# EAGLE schematic circuit (EAGLE 9.4.0)
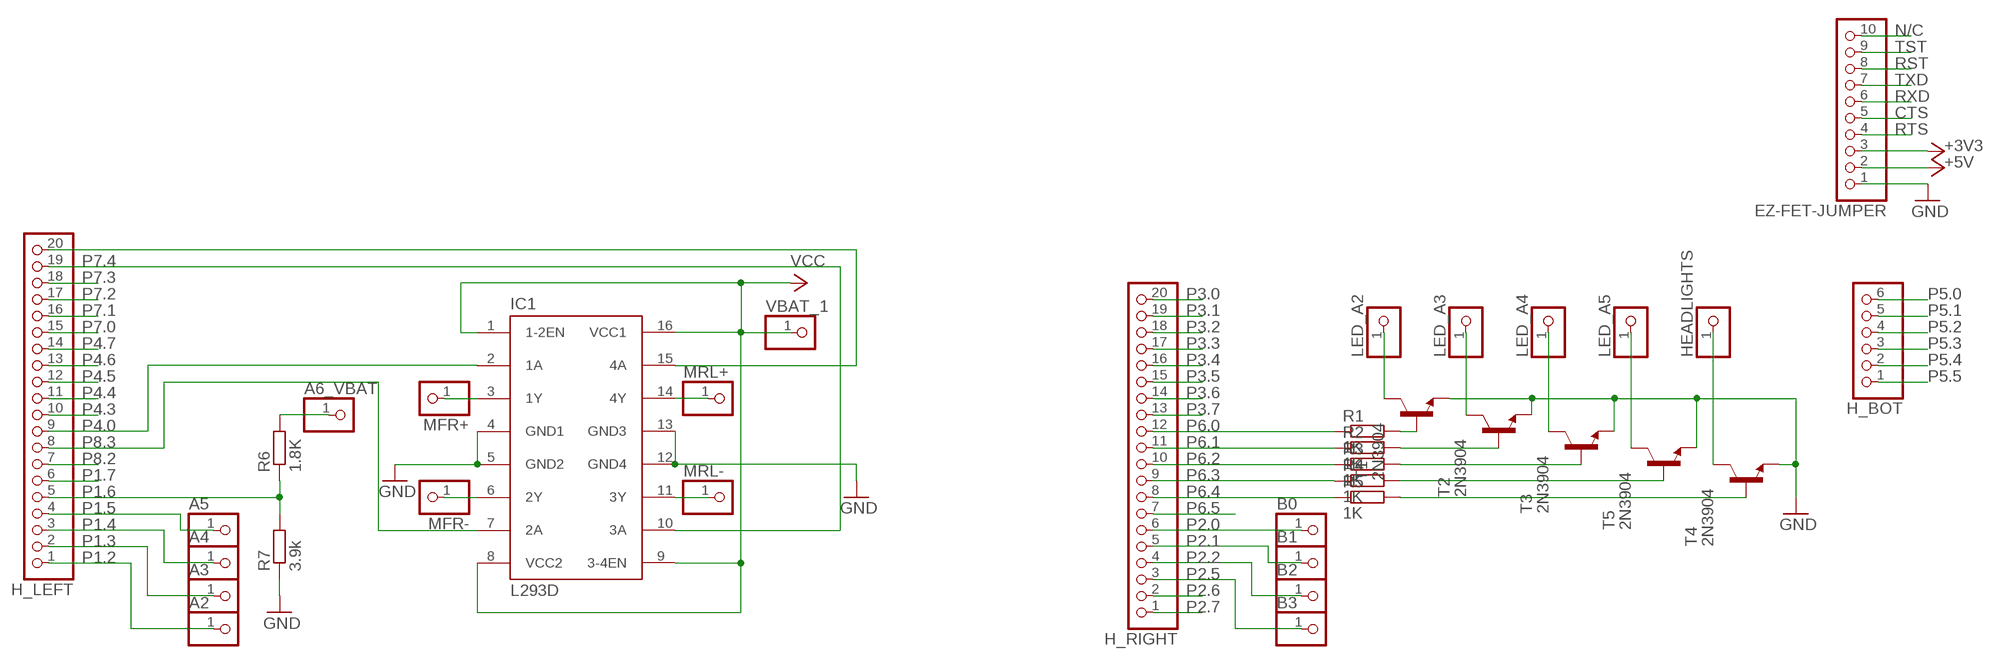
[diagram p0: schematic, sheet 1]

## Parts
A2  PINHD-1X1  [1X01]
A3  PINHD-1X1  [1X01]
A4  PINHD-1X1  [1X01]
A5  PINHD-1X1  [1X01]
A6_VBAT  PINHD-1X1  [1X01]
B0  PINHD-1X1  [1X01]
B1  PINHD-1X1  [1X01]
B2  PINHD-1X1  [1X01]
B3  PINHD-1X1  [1X01]
EZ-FET-JUMPER  PINHD-1X10  [1X10]
H_BOT  PINHD-1X6  [1X06]
H_LEFT  PINHD-1X20  [1X20]
H_RIGHT  PINHD-1X20  [1X20]
HEADLIGHTS  PINHD-1X1  [1X01]
IC1  L293D  [DIL16]
LED_A2  PINHD-1X1  [1X01]
LED_A3  PINHD-1X1  [1X01]
LED_A4  PINHD-1X1  [1X01]
LED_A5  PINHD-1X1  [1X01]
MFR+  PINHD-1X1  [1X01]
MFR-  PINHD-1X1  [1X01]
MRL+  PINHD-1X1  [1X01]
MRL-  PINHD-1X1  [1X01]
R1  1K  R-EU_0207/7  [0207/7]
R2  1K  R-EU_0207/7  [0207/7]
R3  1K  R-EU_0207/7  [0207/7]
R4  1K  R-EU_0207/7  [0207/7]
R5  1K  R-EU_0207/7  [0207/7]
R6  1.8K  R-EU_0207/7  [0207/7]
R7  3.9k  R-EU_0207/7  [0207/7]
T1  2N3904  [TO92]
T2  2N3904  [TO92]
T3  2N3904  [TO92]
T4  2N3904  [TO92]
T5  2N3904  [TO92]
VBAT_1  PINHD-1X1  [1X01]

## Nets
+3V3: EZ-FET-JUMPER.3
+5V: EZ-FET-JUMPER.2
CTS: EZ-FET-JUMPER.5
GND: EZ-FET-JUMPER.1 IC1.4(GND1) IC1.5(GND2) IC1.12(GND4) IC1.13(GND3) R7.1 T1.3(E) T2.3(E) T3.3(E) T4.3(E) T5.3(E)
LED_A3: LED_A3.1 T2.1(C)
N$1: R1.2 T1.2(B)
N$2: R2.2 T2.2(B)
N$3: R3.2 T3.2(B)
N$4: R4.2 T5.2(B)
N$5: R5.2 T4.2(B)
N$6: LED_A2.1 T1.1(C)
N$7: A6_VBAT.1 R6.2
N$8: LED_A4.1 T3.1(C)
N$9: LED_A5.1 T5.1(C)
N$10: HEADLIGHTS.1 T4.1(C)
N$11: IC1.3(1Y) MFR+.1
N$12: IC1.6(2Y) MFR-.1
N$13: IC1.11(3Y) MRL-.1
N$14: IC1.14(4Y) MRL+.1
N/C: EZ-FET-JUMPER.10
P1.2: A2.1 H_LEFT.1
P1.3: A3.1 H_LEFT.2
P1.4: A4.1 H_LEFT.3
P1.5: A5.1 H_LEFT.4
P1.6: H_LEFT.5 R6.1 R7.2
P1.7: H_LEFT.6
P2.0: B0.1 H_RIGHT.6
P2.1: B1.1 H_RIGHT.5
P2.2: B2.1 H_RIGHT.4
P2.5: B3.1 H_RIGHT.3
P2.6: H_RIGHT.2
P2.7: H_RIGHT.1
P3.0: H_RIGHT.20
P3.1: H_RIGHT.19
P3.2: H_RIGHT.18
P3.3: H_RIGHT.17
P3.4: H_RIGHT.16
P3.5: H_RIGHT.15
P3.6: H_RIGHT.14
P3.7: H_RIGHT.13
P4.0: H_LEFT.9 IC1.2(1A)
P4.3: H_LEFT.10
P4.4: H_LEFT.11
P4.5: H_LEFT.12
P4.6: H_LEFT.13
P4.7: H_LEFT.14
P5.0: H_BOT.6
P5.1: H_BOT.5
P5.2: H_BOT.4
P5.3: H_BOT.3
P5.4: H_BOT.2
P5.5: H_BOT.1
P6.0: H_RIGHT.12 R1.1
P6.1: H_RIGHT.11 R2.1
P6.2: H_RIGHT.10 R3.1
P6.3: H_RIGHT.9 R4.1
P6.4: H_RIGHT.8 R5.1
P6.5: H_RIGHT.7
P7.0: H_LEFT.15
P7.1: H_LEFT.16
P7.2: H_LEFT.17
P7.3: H_LEFT.18
P7.4: H_LEFT.19 IC1.10(3A)
P7.5: H_LEFT.20 IC1.15(4A)
P8.2: H_LEFT.7
P8.3: H_LEFT.8 IC1.7(2A)
RST: EZ-FET-JUMPER.8
RTS: EZ-FET-JUMPER.4
RXD: EZ-FET-JUMPER.6
TST: EZ-FET-JUMPER.9
TXD: EZ-FET-JUMPER.7
VCC: IC1.1(1-2EN) IC1.8(VCC2) IC1.9(3-4EN) IC1.16(VCC1) VBAT_1.1

## Library data of the parts
A2-A5 A6_VBAT B0 B1-B3 HEADLIGHTS LED_A2-LED_A5 MFR+ MFR- MRL+ MRL- VBAT_1 = pinhead:PINHD-1X1: PIN HEADER
EZ-FET-JUMPER = pinhead:PINHD-1X10: PIN HEADER
H_BOT = pinhead:PINHD-1X6: PIN HEADER
H_LEFT H_RIGHT = pinhead:PINHD-1X20: PIN HEADER
IC1 = st-microelectronics:L293D: PUSH-PULL 4 CHANNEL DRIVER; MPN: L293D; OC_FARNELL: 9589619; OC_NEWARK: 56P8249
R1-R7 = rcl:R-EU_: RESISTOR, European symbol; SPICEPREFIX: R
T1-T5 = transistor:2N3904: NPN TRANSISTOR